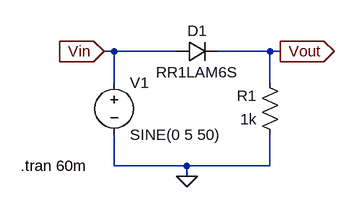
[diagram p0: schematic Draft16.asc]
Draft16.asc, the LTspice schematic file:
Version 4
SHEET 1 880 680
WIRE 16 64 0 64
WIRE 112 64 16 64
WIRE 256 64 176 64
WIRE 272 64 256 64
WIRE 16 112 16 64
WIRE 256 112 256 64
WIRE 16 240 16 192
WIRE 128 240 16 240
WIRE 256 240 256 192
WIRE 256 240 128 240
WIRE 128 256 128 240
FLAG 128 256 0
FLAG 272 64 Vout
IOPIN 272 64 Out
FLAG 0 64 Vin
IOPIN 0 64 In
SYMBOL diode 112 80 R270
WINDOW 0 32 32 VTop 2
WINDOW 3 0 32 VBottom 2
SYMATTR InstName D1
SYMATTR Value RR1LAM6S
SYMBOL res 272 208 R180
WINDOW 0 36 76 Left 2
WINDOW 3 36 40 Left 2
SYMATTR InstName R1
SYMATTR Value 1k
SYMBOL voltage 16 96 R0
WINDOW 123 0 0 Left 0
WINDOW 39 0 0 Left 0
SYMATTR InstName V1
SYMATTR Value SINE(0 5 50)
TEXT -128 240 Left 2 !.tran 60m

The netlist it stands for:
* Draft16.asc
D1 Vin Vout RR1LAM6S
R1 0 Vout 1k
V1 Vin 0 SINE(0 5 50)
.model D D
.lib standard.dio
.tran 60m
.backanno
.end

* Results of the author's LTspice run, read from the files saved beside the schematic
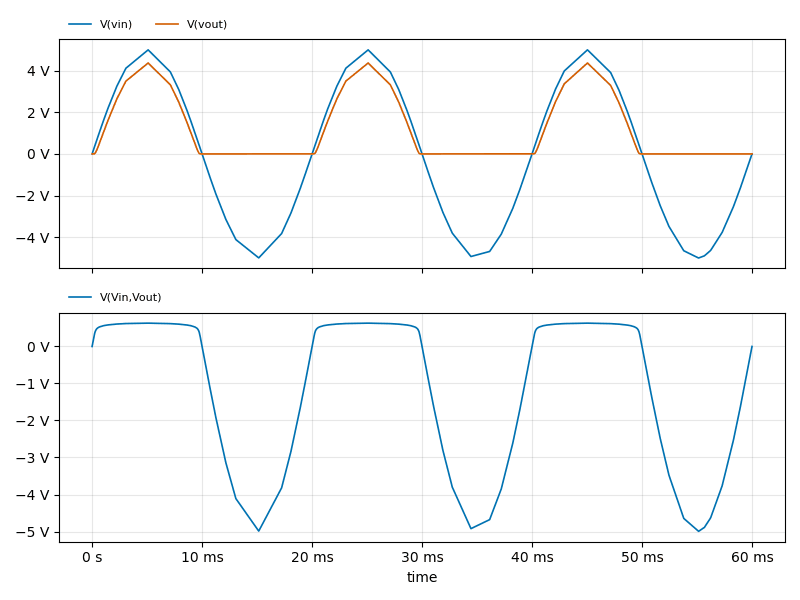
[diagram p1: Transient Analysis of Draft16.asc, plotted from the saved traces]
* Transient Analysis, 1 run:
*   V(vin): min -4.995 V, max 4.994 V, average -10.48 mV, rms 3.476 V, last 0 V
*   V(vout): min -32.67 µV, max 4.363 V, average 1.268 V, rms 2.063 V, last 24.72 µV
*   V(Vin,Vout): min -4.995 V, max 630.6 mV, average -1.279 V, rms 2.503 V, last -24.72 µV